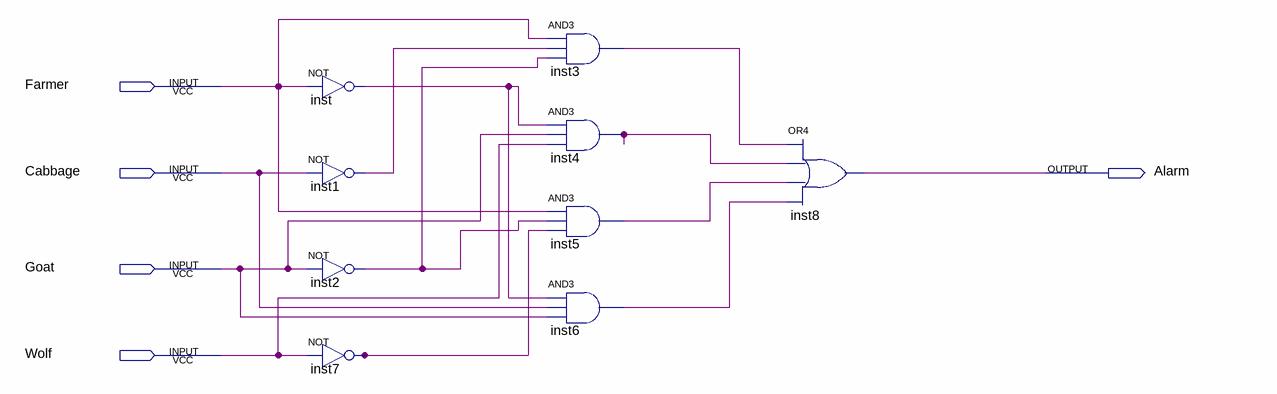
[diagram p0: schematic sheet]
// Quartus schematic lab3step3.bdf as structural Verilog: 9 symbols, 5 pins
module lab3step3 (
  input  Farmer,
  input  Cabbage,
  input  Goat,
  input  Wolf,
  output Alarm
);

  wire inst1_out, inst2_out, inst3_out, inst4_out, inst5_out, inst6_out, inst7_out, inst_out;

  not inst (inst_out, Farmer);
  not inst1 (inst1_out, Cabbage);
  not inst2 (inst2_out, Goat);
  not inst7 (inst7_out, Wolf);
  and inst3 (inst3_out, Farmer, inst1_out, inst2_out);
  and inst4 (inst4_out, inst_out, Goat, Wolf);
  and inst5 (inst5_out, Farmer, inst2_out, inst7_out);
  and inst6 (inst6_out, inst_out, Cabbage, Goat);
  or inst8 (Alarm, inst3_out, inst4_out, inst5_out, inst6_out);
endmodule
